# Altium schematic sheet 2560TK_Schematic.SchDoc
size A2; Organization: Altium Limited; Address1: L3, 12a Rodborough Rd; Address2: Frenchs Forest; Address3: NSW; Address4: Australia 2086
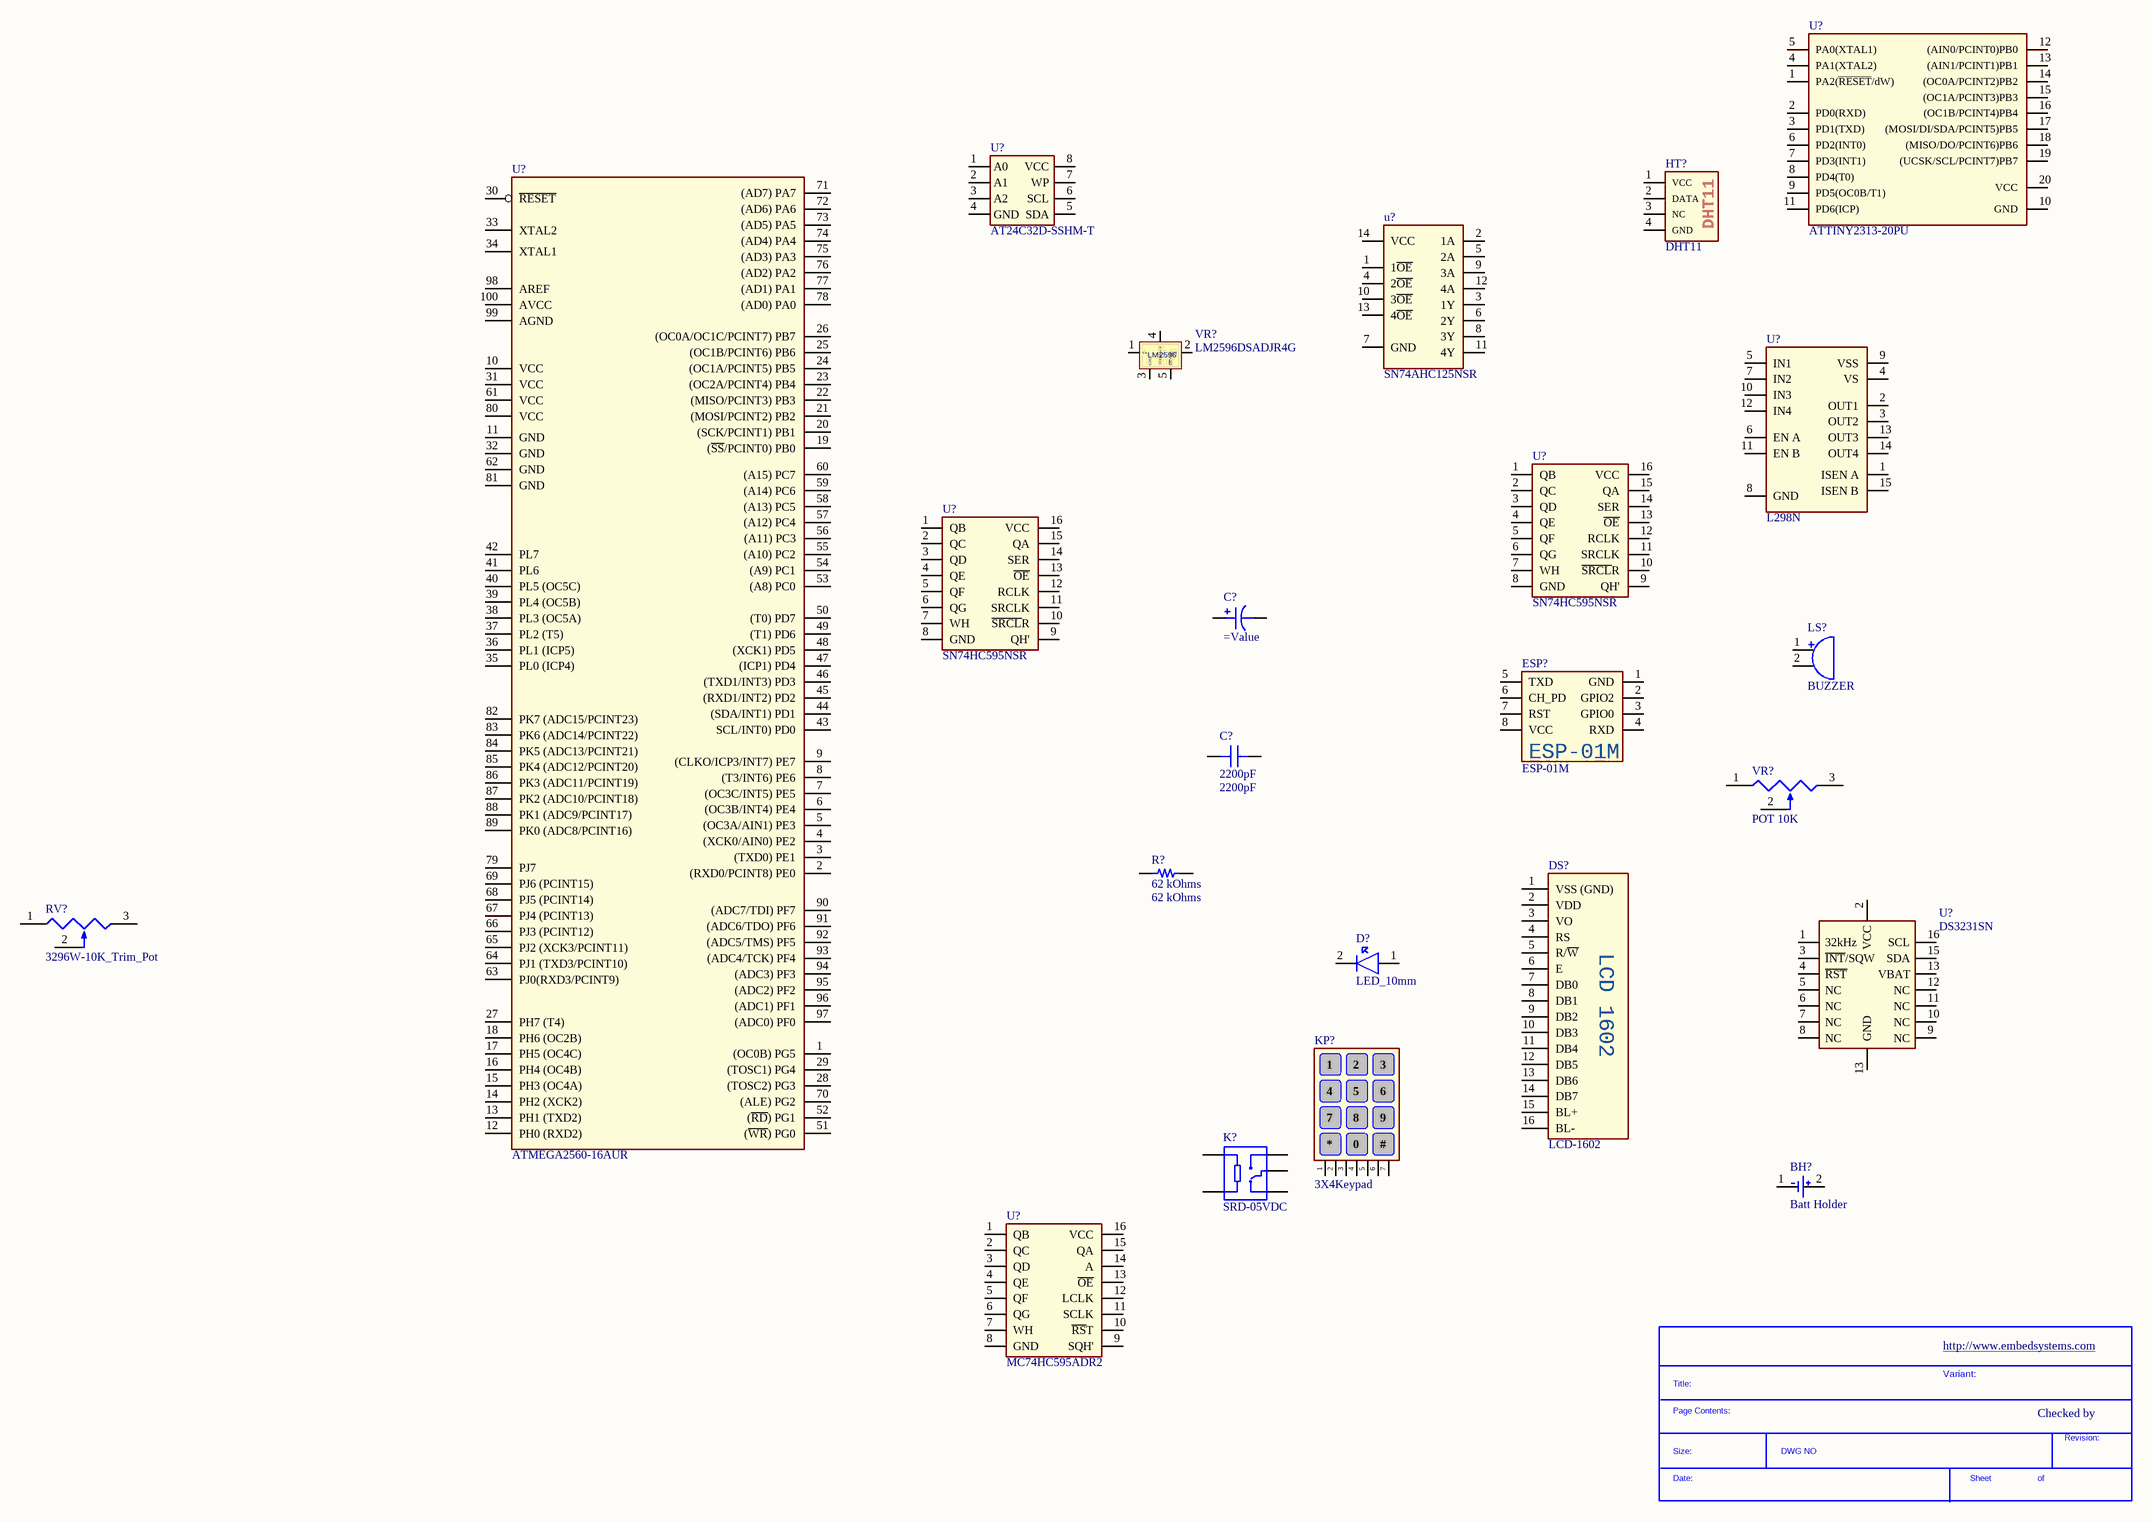
[diagram p0: 2560TK_Schematic.SchDoc]

## Parts
(Parts that share a designator on the sheet are numbered #1, #2 ... from top to bottom, then left to right.)
*?  SDTitleBlock  (value not drawn)  (graphical)
BH?  Batt Holder  [Batt Holder]
C?#1  (no value)  [CAP ALSMD POLY 4.3MM H5.5MM]
C?#2  2200pF  [CAP 0603_1608]
D?  LED_10mm  [LED_10mm]
DS?  LCD-1602  [LCD1602]
ESP?  ESP-01M  [ESP-01]
HT?  DHT11  [DHT11]
K?  SRD-05VDC  [SRD-05VDC]
KP?  3X4Keypad  [COM-08653]
LS?  BUZZER  [BUZZER]
R?  62 kOhms  [RES 0603_1608]
RV?  3296W-10K_Trim_Pot  [3296W_TrimPot]
U?#1  ATTINY2313-20PU  [DIP20]
U?#2  AT24C32D-SSHM-T  [8-Pin TTSOP]
u?#3  SN74AHC125NSR  [14-SOIC_5.3MM]
U?#4  L298N  [Multiwatt15]
U?#5  SN74HC595NSR  [SOIC16]
U?#6  SN74HC595NSR  [SOIC16]
U?#7  DS3231SN  [16 SO]
U?#8  ATMEGA2560-16AUR  [100pinTQFP]
U?#9  MC74HC595ADR2  [SOIC-16]
VR?#1  LM2596DSADJR4G  [D2PAK 5_LEAD]
VR?#2  POT 10K  [5MM_POT]

## Nets

Not connected (* = marked no-connect by the designer): BH? 1 2; C?#1 1 2; C?#2 1 2; D? 1 2; DS? 1(VSS_(GND)) 2(VDD) 3(VO) 4(RS) 5(R/~{W}) 6(E) 7(DB0) 8(DB1) 9(DB2) 10(DB3) 11(DB4) 12(DB5) 13(DB6) 14(DB7) 15(BL+) 16(BL-); ESP? 1(GND) 2(GPIO2) 3(GPIO0) 4(RXD) 5(TXD) 6(CH_PD) 7(RST) 8(VCC); HT? 1(VCC) 2(DATA) 3(NC) 4(GND); K? A1 A2 COM NC NO; KP? 1 2 3 4 5 6 7; LS? 1 2; R? 1 2; RV? 1 2 3; U?#1 1(PA2(~{RESET}/dW)) 2(PD0(RXD)) 3(PD1(TXD)) 4(PA1(XTAL2)) 5(PA0(XTAL1)) 6(PD2(INT0)) 7(PD3(INT1)) 8(PD4(T0)) 9(PD5(OC0B/T1)) 10(GND) 11(PD6(ICP)) 12((AIN0/PCINT0)PB0) 13((AIN1/PCINT1)PB1) 14((OC0A/PCINT2)PB2) 15((OC1A/PCINT3)PB3) 16((OC1B/PCINT4)PB4) 17((MOSI/DI/SDA/PCINT5)PB5) 18((MISO/DO/PCINT6)PB6) 19((UCSK/SCL/PCINT7)PB7) 20(VCC); U?#2 1(A0) 2(A1) 3(A2) 4(GND) 5(SDA) 6(SCL) 7(WP) 8(VCC); u?#3 1(1~{OE}) 2(1A) 3(1Y) 4(2~{OE}) 5(2A) 6(2Y) 7(GND) 8(3Y) 9(3A) 10(3~{OE}) 11(4Y) 12(4A) 13(4~{OE}) 14(VCC); U?#4 1(ISEN_A) 2(OUT1) 3(OUT2) 4(VS) 5(IN1) 6(EN_A) 7(IN2) 8(GND) 9(VSS) 10(IN3) 11(EN_B) 12(IN4) 13(OUT3) 14(OUT4) 15(ISEN_B); U?#5 1(QB) 2(QC) 3(QD) 4(QE) 5(QF) 6(QG) 7(WH) 8(GND) 9(QH') 10(~{SRCL}R) 11(SRCLK) 12(RCLK) 13(~{OE}) 14(SER) 15(QA) 16(VCC); U?#6 1(QB) 2(QC) 3(QD) 4(QE) 5(QF) 6(QG) 7(WH) 8(GND) 9(QH') 10(~{SRCL}R) 11(SRCLK) 12(RCLK) 13(~{OE}) 14(SER) 15(QA) 16(VCC); U?#7 1(32kHz) 2(VCC) 3(~{INT}/SQW) 4(~{RST}) 5(NC) 6(NC) 7(NC) 8(NC) 9(NC) 10(NC) 11(NC) 12(NC) 13(VBAT) 15(SDA) 16(SCL); U?#8 1((OC0B)_PG5) 2((RXD0/PCINT8)_PE0) 3((TXD0)_PE1) 4((XCK0/AIN0)_PE2) 5((OC3A/AIN1)_PE3) 6((OC3B/INT4)_PE4) 7((OC3C/INT5)_PE5) 8((T3/INT6)_PE6) 9((CLKO/ICP3/INT7)_PE7) 10(VCC) 11(GND) 12(PH0_(RXD2)) 13(PH1_(TXD2)) 14(PH2_(XCK2)) 15(PH3_(OC4A)) 16(PH4_(OC4B)) 17(PH5_(OC4C)) 18(PH6_(OC2B)) 19((~{SS}/PCINT0)_PB0) 20((SCK/PCINT1)_PB1) 21((MOSI/PCINT2)_PB2) 22((MISO/PCINT3)_PB3) 23((OC2A/PCINT4)_PB4) 24((OC1A/PCINT5)_PB5) 25((OC1B/PCINT6)_PB6) 26((OC0A/OC1C/PCINT7)_PB7) 27(PH7_(T4)) 28((TOSC2)_PG3) 29((TOSC1)_PG4) 30(~{RESET}) 31(VCC) 32(GND) 33(XTAL2) 34(XTAL1) 35(PL0_(ICP4)) 36(PL1_(ICP5)) 37(PL2_(T5)) 38(PL3_(OC5A)) 39(PL4_(OC5B)) 40(PL5_(OC5C)) 41(PL6) 42(PL7) 43(SCL/INT0)_PD0) 44((SDA/INT1)_PD1) 45((RXD1/INT2)_PD2) 46((TXD1/INT3)_PD3) 47((ICP1)_PD4) 48((XCK1)_PD5) 49((T1)_PD6) 50((T0)_PD7) 51((~{WR})_PG0) 52((~{RD})_PG1) 53((A8)_PC0) 54((A9)_PC1) 55((A10)_PC2) 56((A11)_PC3) 57((A12)_PC4) 58((A13)_PC5) 59((A14)_PC6) 60((A15)_PC7) 61(VCC) 62(GND) 63(PJ0(RXD3/PCINT9)) 64(PJ1_(TXD3/PCINT10)) 65(PJ2_(XCK3/PCINT11)) 66(PJ3_(PCINT12)) 67(PJ4_(PCINT13)) 68(PJ5_(PCINT14)) 69(PJ6_(PCINT15)) 70((ALE)_PG2) 71((AD7)_PA7) 72((AD6)_PA6) 73((AD5)_PA5) 74((AD4)_PA4) 75((AD3)_PA3) 76((AD2)_PA2) 77((AD1)_PA1) 78((AD0)_PA0) 79(PJ7) 80(VCC) 81(GND) 82(PK7_(ADC15/PCINT23)) 83(PK6_(ADC14/PCINT22)) 84(PK5_(ADC13/PCINT21)) 85(PK4_(ADC12/PCINT20)) 86(PK3_(ADC11/PCINT19)) 87(PK2_(ADC10/PCINT18)) 88(PK1_(ADC9/PCINT17)) 89(PK0_(ADC8/PCINT16)) 90((ADC7/TDI)_PF7) 91((ADC6/TDO)_PF6) 92((ADC5/TMS)_PF5) 93((ADC4/TCK)_PF4) 94((ADC3)_PF3) 95((ADC2)_PF2) 96((ADC1)_PF1) 97((ADC0)_PF0) 98(AREF) 99(AGND) 100(AVCC); U?#9 1(QB) 2(QC) 3(QD) 4(QE) 5(QF) 6(QG) 7(WH) 8(GND) 9(SQH') 10(~{RS}T) 11(SCLK) 12(LCLK) 13(~{OE}) 14(A) 15(QA) 16(VCC); VR?#1 1(Vin) 2(OUT) 3(GND) 4(FEEDBACK) 5(~{ON}/OFF); VR?#2 1 2 3

## Notes on the sheet
- http://www.embedsystems.com
- Variant:
- Checked by
- Title
- Size:
- Date:
- File:
- A2
- Number:
- Time:
- Revision:
- Sheet
- of
- (in symbol 3X4Keypad) 8; 9; 0; #
- (in symbol LCD-1602) LCD 1602
- (in symbol SDTitleBlock) Title:; Page Contents:; Revision:; Size:; DWG NO; Date:; Sheet; of

## Library data of the parts
BH? = Batt Holder: BATTERY HOLDER COIN 20MM PC PIN; Manufacturer: Memory Protection Devices; Manufacturer Part Number: BS-7; Number of Cells: 1; Supplier 1: Digi-Key; RoHS: No; Category: Batteries and Accessories; Stock 1: 55851; Pricing 1: 1=0.78000, 10=0.66000, 50=0.57880, 100=0.54570, 250=0.50236, 500=0.47176, 1000=0.44115, 2500=0.40290, 5000=0.37230 (USD); Mount: Through Hole,PCB; Min Operating Temperature: -55°C; Max Operating Temperature: 105°C; Package Quantity: 100; Termination: PC Pin; Diameter: 20mm; Lead Free: Lead Free; ComponentLink1URL: https://datasheet.ciiva.com/3/bs-7-datasheet-3824.pdf?src-supplier=Digi-Key; ComponentLink1Description: https://datasheet.ciiva.com/3/bs-7-datasheet-3824.pdf?src-supplier=Digi-Key; Supplier Part Number 1: BS-7-ND
C?#1 = EEE-1CA220WAR: CAP ALUM 22UF 20% 16V SMD; Part Number: EEE-1CA220WAR
C?#2 = C0603C222K5HACTU: CAP CER 2200PF 50V X8R 0603; Part Number: C0603C222K5HACTU; Value: 2200pF
D? = LED_10mm: 10MM Yellow Led; Manufacturer: SunLED; Manufacturer Part Number: XLMYK01D; Stock 1: 50; Pricing 1: 1=0.67000, 10=0.41100, 100=0.23650, 1000=0.18508, 2000=0.16966, 5000=0.15423, 10000=0.14395, 25000=0.13881 (USD); Supplier 1: Digi-Key; Supplier Part Number 1: 1497-XLMYK01D-ND
DS? = LCD-1602: LUMEX         LCM-S01602DTR/C             Alphanumeric LCD, 16 x 2, Black on Grey, 5V, Parallel, English, Japanese, Reflective; Number of Characters: 32; Character Height: 5.56mm; Character Width: 2.96mm; Background Color: Green; Number Of Characters Per Row: 16; Current Rating: 3mA; Viewing Area (width): 66mm; Viewing Area (height): 16mm; Supplier 1: Digi-Key; Manufacturer: Lumex; Manufacturer Part Number: LCM-S01602DTR/C; RoHS: Yes; Category: LCD, OLED, Graphic Displays; Stock 1: 70; Pricing 1: 1=11.49000, 10=8.33200, 100=6.88450, 500=6.02938, 1000=5.70050, 2000=5.56895, 5000=5.48125, 10000=5.37163 (USD); Case/Package: Module; Min Operating Temperature: 0°C; Max Operating Temperature: 50°C; Interface: Parallel; Operating Supply Voltage: 5V; Packaging: Bulk; Package Quantity: 45; Voltage Rating: 5V; Length: 85mm; Width: 85mm; Height: 30mm; REACH SVHC: No SVHC; Lead Free: Lead Free; ComponentLink1URL: https://datasheet.ciiva.com/1314/1701289-1314455.pdf?src-supplier=Newark; ComponentLink1Description: https://datasheet.ciiva.com/1314/1701289-1314455.pdf?src-supplier=Newark; ComponentLink2URL: https://datasheet.ciiva.com/1227/1701289-1227260.pdf?src-supplier=Element14; ComponentLink2Description: https://datasheet.ciiva.com/1227/1701289-1227260.pdf?src-supplier=Element14; Supplier Part Number 1: 67-1780-ND
ESP? = ESP-01M: TXRX ESP8266 MOD WIFI TRACE ANT; Manufacturer: Seeed Studio; Manufacturer Part Number: 317060016; RoHS: No; Category: Embedded Processors and Controllers; Stock 1: 190; Pricing 1: 1=7.09000 (USD); Case/Package: Module; Weight: 0.0625lb; Length: 3.25inch; Width: 2.25inch; Height: 0.25inch; ComponentLink1URL: https://media.digikey.com/pdf/Data%20Sheets/Seeed%20Technology/317060016_Web.pdf?src-supplier=Digi-Key; ComponentLink1Description: https://media.digikey.com/pdf/Data%20Sheets/Seeed%20Technology/317060016_Web.pdf?src-supplier=Digi-Key; Supplier 1: Digi-Key; Supplier Part Number 1: 1597-1145-ND
HT? = DHT11: SENSOR HUMID/TEMP 5V DTL 5% MOD; Manufacturer: Adafruit Industries; Manufacturer Part Number: 386; Response Time: 1s; Sensor Type: Temperature; Output Type: Digital; RoHS: Yes; Category: Optoelectronics; Stock 1: 753; Pricing 1: 1=5.00000 (USD); Mount: Chassis Mount; Min Operating Temperature: 0°C; Max Operating Temperature: 50°C; Accuracy: 5%; ComponentLink1URL: https://media.digikey.com/pdf/Data%20Sheets/Adafruit%20PDFs/DHT11_ProdManual.pdf?src-supplier=Digi-Key; ComponentLink1Description: https://media.digikey.com/pdf/Data%20Sheets/Adafruit%20PDFs/DHT11_ProdManual.pdf?src-supplier=Digi-Key; Supplier 1: Digi-Key; Supplier Part Number 1: 1528-1228-ND
K? = SRD-05VDC: TE CONNECTIVITY - 1-1721150-0 - POWER RELAY, SPDT, 277VAC, 10A, TH; Manufacturer: TE Connectivity P&B; Contact Current Rating: 15A; Coil Voltage (DC): 5V; Voltage Rating (AC): 125V; Manufacturer Part Number: 1-1721150-0; RoHS: Yes; Category: Signal Relays; Stock 1: 9261; Pricing 1: 1=1.34000, 10=1.26000, 25=1.12000, 50=1.06400, 100=1.00800, 250=0.89600, 500=0.84000, 1000=0.78400, 5000=0.75600 (USD); Mount: Through Hole; Number of Pins: 5; Weight: 9.5g; Max Operating Temperature: 85°C; Packaging: Rail/Tube; Throw Configuration: SPDT; Termination: PCB; Length: 19mm; Width: 15.5mm; Height: 15.8mm; Depth: 15.5mm; Lead Free: Lead Free; ELV: Compliant; ComponentLink1URL: https://datasheet.ciiva.com/14189/eng-cd-1721150-c-14189465.pdf?src-supplier=Avnet; ComponentLink1Description: https://datasheet.ciiva.com/14189/eng-cd-1721150-c-14189465.pdf?src-supplier=Avnet; ComponentLink2URL: https://datasheet.ciiva.com/48542/eng-cd-1721150-c-48542490.pdf?src-supplier=Onlinecomponents.com; ComponentLink2Description: https://datasheet.ciiva.com/48542/eng-cd-1721150-c-48542490.pdf?src-supplier=Onlinecomponents.com; Supplier 1: Digi-Key; Supplier Part Number 1: PB2032-ND
KP? = 3X4Keypad: 3x4 Matrix Keypad; Manufacturer: Adafruit Industries; Manufacturer Part Number: 3845; Stock 1: 43; Pricing 1: 1=6.50000 (USD); Supplier 1: Digi-Key; Supplier Part Number 1: 1528-2673-ND
LS? = BUZZER: AUDIO MAGNETIC XDCR 3-7V TH; Manufacturer: Projects Unlimited; Manufacturer Part Number: AT-1224-TWT-5V-2-R; Voltage Rating: 5V; Frequency: 2.4kHz; Operating Supply Current: 40mA; RoHS: Yes; Category: Audio Products; Stock 1: 83564; Pricing 1: 1=0.61000, 5=0.54600, 10=0.52000, 25=0.48640, 50=0.46120, 100=0.43680, 500=0.38252, 1000=0.36032, 5000=0.31168 (USD); Mount: Through Hole; Contact Plating: Tin; Min Operating Temperature: -30°C; Max Operating Temperature: 70°C; Packaging: Tray; Termination: PC Pins; Sensing Method: Magnetic; Max Supply Current: 40mA; Diameter: 12mm; Height: 9mm; ComponentLink1URL: http://www.mouser.com/ds/2/334/AT-1224-TWT-5V-2-R-532234.pdf?src-supplier=Mouser; ComponentLink1Description: http://www.mouser.com/ds/2/334/AT-1224-TWT-5V-2-R-532234.pdf?src-supplier=Mouser; ComponentLink2URL: http://www.puiaudio.com/pdf/AT-1224-TWT-5V-2-R.pdf?src-supplier=Digi-Key; ComponentLink2Description: http://www.puiaudio.com/pdf/AT-1224-TWT-5V-2-R.pdf?src-supplier=Digi-Key; ComponentLink3URL: http://www.puiaudio.com/pdf/AT-1224-TWT-5V-2-R.pdf?src-supplier=Avnet; ComponentLink3Description: http://www.puiaudio.com/pdf/AT-1224-TWT-5V-2-R.pdf?src-supplier=Avnet; Supplier 1: Digi-Key; Supplier Part Number 1: 668-1470-ND
R? = ERJ-PB3B6202V: RES SMD 62K OHM 0.1% 1/5W 0603; Part Number: ERJ-PB3B6202V; Value: 62 kOhms
RV? = 3296W-10K_Trim_Pot: TRIMMER 10K OHM 0.5W PC PIN TOP; Manufacturer: Bourns; Manufacturer Part Number: 3296W-1-103; Tolerance: 10%; Power Rating: 500mW; Resistance: 10kR; Number of Turns: 25; Temperature Coefficient: 100ppm/°C; Voltage Rating (DC): 500V; RoHS: No; Category: Variable Resistors and Potentiometers; Stock 1: 58; Pricing 1: 1=4.38000, 10=3.83600, 25=3.42520, 50=3.21960, 100=3.15100, 250=3.01400, 500=2.46600, 1000=2.12350, 5000=1.91800 (USD); Mount: PCB,Through Hole; Weight: 0.03oz; Color: Blue; Contact Plating: Tin,Lead; Min Operating Temperature: -55°C; Max Operating Temperature: 125°C; Package Quantity: 50; Packaging: Rail/Tube; Termination: Pin; Resistor Type: Cermet; Max Power Dissipation: 500mW; Taper: Linear; Series: Trimpot® 3296 - Sealed; Technology: CERMET; Resistance Tolerance: 10%; Length: 9.53mm; Width: 9.53mm; Height: 0.395inch; Depth: 4.83mm; Thickness: 5.59mm; Radiation Hardening: No; REACH SVHC: No SVHC; Military Standard: Not; RoHS Compliant: No; ComponentLink1URL: https://datasheet.ciiva.com/3266/3296-3266186.pdf?src-supplier=Avnet; ComponentLink1Description: https://datasheet.ciiva.com/3266/3296-3266186.pdf?src-supplier=Avnet; ComponentLink2URL: https://datasheet.ciiva.com/2164/3296-2164077.pdf?src-supplier=Digi-Key; ComponentLink2Description: https://datasheet.ciiva.com/2164/3296-2164077.pdf?src-supplier=Digi-Key; ComponentLink3URL: https://datasheet.ciiva.com/1570/1815117-1570414.pdf?src-supplier=Newark; ComponentLink3Description: https://datasheet.ciiva.com/1570/1815117-1570414.pdf?src-supplier=Newark; Supplier Part Number 1: 3296W-103-ND
U?#1 = ATTINY2313-20PU: ATMEL         ATTINY2313-20PU            8 Bit Microcontroller, Low Power High Performance, ATtiny, 20 MHz, 2 KB, 128 Byte, 20 Pins, DIP; Manufacturer: Microchip / Atmel; Interface: SPI,UART,USART; Min Supply Voltage: 2.7V; Max Supply Voltage: 5.5V; Frequency: 20MHz; Oscillator Type: Internal; Memory Type: FLASH,EEPROM; Memory Size: 2KB; Peripherals: Brown-out Detect/Reset,POR,PWM,WDT; Number of Timers/Counters: 2; RAM Size: 128B; Number of I/Os: 18; Number of PWM Channels: 4; Number of UART Channels: 1; Data Bus Width: 8b; Number of Bits: 8; Watchdog Timer: Yes; Access Time: 20us; Core Architecture: AVR; Manufacturer Part Number: ATTINY2313-20PU; RoHS: Yes; Category: Microcontrollers; Stock 1: 1963; Pricing 1: 1=1.93000, 25=1.77120, 100=1.59500 (USD); Mount: Through Hole; Case/Package: DIP; Number of Pins: 20; Contact Plating: Tin,Matte; Min Operating Temperature: -40°C; Max Operating Temperature: 85°C; Packaging: Rail/Tube; Package Quantity: 18; Density: 2KB; Number of Programmable I/O: 18; Max Frequency: 20MHz; Number of SPI Channels: 2; Number of I2C Channels: 1; Address Bus Width: 8b; Series: AVR® ATtiny; Length: 25.98mm; Width: 7.112mm; Height: 4.953mm; Radiation Hardening: No; RoHS Compliant: Yes; REACH SVHC: No SVHC; Lead Free: Lead Free; ComponentLink1URL: https://datasheet.ciiva.com/1167/doc2543-1167040.pdf?src-supplier=Newark; ComponentLink1Description: https://datasheet.ciiva.com/1167/doc2543-1167040.pdf?src-supplier=Newark; ComponentLink2URL: https://datasheet.ciiva.com/19481/1537061-19481586.pdf?src-supplier=Jameco; ComponentLink2Description: https://datasheet.ciiva.com/19481/1537061-19481586.pdf?src-supplier=Jameco; ComponentLink3URL: https://datasheet.ciiva.com/15122/getdatasheetpartid-143079-15122628.pdf?src-supplier=Verical; ComponentLink3Description: https://datasheet.ciiva.com/15122/getdatasheetpartid-143079-15122628.pdf?src-supplier=Verical; ComponentLink4URL: https://datasheet.ciiva.com/20168/73-4316-20168308.pdf?src-supplier=Rapid+Electronics; ComponentLink4Description: https://datasheet.ciiva.com/20168/73-4316-20168308.pdf?src-supplier=Rapid+Electronics; ComponentLink5URL: https://datasheet.ciiva.com/14132/gn645062-14132485.pdf?src-supplier=Distrelec; ComponentLink5Description: https://datasheet.ciiva.com/14132/gn645062-14132485.pdf?src-supplier=Distrelec; ComponentLink6URL: https://datasheet.ciiva.com/1158/1131078-1158423.pdf?src-supplier=Element14; ComponentLink6Description: https://datasheet.ciiva.com/1158/1131078-1158423.pdf?src-supplier=Element14; ComponentLink7URL: https://datasheet.ciiva.com/26207/doc2543-26207001.pdf?src-supplier=Avnet+Europe; ComponentLink7Description: https://datasheet.ciiva.com/26207/doc2543-26207001.pdf?src-supplier=Avnet+Europe; ComponentLink8URL: https://datasheet.ciiva.com/6639/doc2543-6639931.pdf?src-supplier=Digi-Key; ComponentLink8Description: https://datasheet.ciiva.com/6639/doc2543-6639931.pdf?src-supplier=Digi-Key; ComponentLink9URL: https://datasheet.ciiva.com/3203/doc2543-3203135.pdf?src-supplier=Avnet; ComponentLink9Description: https://datasheet.ciiva.com/3203/doc2543-3203135.pdf?src-supplier=Avnet; Supplier 1: Digi-Key; Supplier Part Number 1: ATTINY2313-20PU-ND
U?#2 = AT24C32D-SSHM-T: EEPROM Serial-2Wire 32K-bit 4K x 8 1.8V/2.5V/3.3V/5V 8-Pin SOIC T/R; Manufacturer: Microchip / Atmel; Min Supply Voltage: 1.7V; Max Supply Voltage: 5.5V; Access Time: 550ns; Density: 32Kb; Frequency: 1MHz; Nominal Supply Current: 3mA; Interface: I2C,Serial,2-Wire; Operating Supply Voltage: 5V; Organization: 4KX8; Write Protection: YES; Write Cycle Time-Max (tWC): 5ms; Manufacturer Part Number: AT24C32D-SSHM-T; RoHS: Yes; Category: EEPROM; Pricing 1: 1=0.44000 (USD); Mount: Surface Mount; Case/Package: SOIC; Number of Pins: 8; Min Operating Temperature: -40°C; Max Operating Temperature: 85°C; Packaging: Tape and Reel; Package Quantity: 1; Memory Type: EEPROM; Memory Size: 32Kb; Max Frequency: 1MHz; Voltage: 5V; Series: -; Access Time-Max: 550ns; Supply Current: 3mA; Supply Voltage-Nom: 5.5V; Radiation Hardening: No; REACH SVHC: No SVHC; Lead Free: Lead Free; RoHS Compliant: Yes; ComponentLink1URL: https://datasheet.ciiva.com/15123/getdatasheetpartid-320868-15123383.pdf?src-supplier=Verical; ComponentLink1Description: https://datasheet.ciiva.com/15123/getdatasheetpartid-320868-15123383.pdf?src-supplier=Verical; ComponentLink2URL: https://datasheet.ciiva.com/5700/1744693-5700966.pdf?src-supplier=Farnell; ComponentLink2Description: https://datasheet.ciiva.com/5700/1744693-5700966.pdf?src-supplier=Farnell; ComponentLink3URL: https://datasheet.ciiva.com/26869/at24c32d-sshm-t-26869756.pdf?src-supplier=IIIC; ComponentLink3Description: https://datasheet.ciiva.com/26869/at24c32d-sshm-t-26869756.pdf?src-supplier=IIIC; ComponentLink4URL: https://datasheet.ciiva.com/6615/atmel-8866-seeprom-at24c32d-datasheet-6615162.pdf?src-supplier=Digi-Key; ComponentLink4Description: https://datasheet.ciiva.com/6615/atmel-8866-seeprom-at24c32d-datasheet-6615162.pdf?src-supplier=Digi-Key; ComponentLink5URL: https://datasheet.ciiva.com/24168/atmel-8850-seeprom-at24c64d-datasheet-24168478.pdf?src-supplier=Future+Electronics; ComponentLink5Description: https://datasheet.ciiva.com/24168/atmel-8850-seeprom-at24c64d-datasheet-24168478.pdf?src-supplier=Future+Electronics; ComponentLink6URL: https://datasheet.ciiva.com/18617/atmel-8866-seeprom-at24c32d-datasheet-18617722.pdf?src-supplier=Digi-Key; ComponentLink6Description: https://datasheet.ciiva.com/18617/atmel-8866-seeprom-at24c32d-datasheet-18617722.pdf?src-supplier=Digi-Key; ComponentLink7URL: https://datasheet.ciiva.com/6615/atmel-8866-seeprom-at24c32d-datasheet-6615163.pdf?src-supplier=Digi-Key; ComponentLink7Description: https://datasheet.ciiva.com/6615/atmel-8866-seeprom-at24c32d-datasheet-6615163.pdf?src-supplier=Digi-Key; ComponentLink8URL: https://datasheet.ciiva.com/22729/1744693-22729500.pdf?src-supplier=Element14; ComponentLink8Description: https://datasheet.ciiva.com/22729/1744693-22729500.pdf?src-supplier=Element14; ComponentLink9URL: https://datasheet.ciiva.com/22618/1744693-22618573.pdf?src-supplier=Element14; ComponentLink9Description: https://datasheet.ciiva.com/22618/1744693-22618573.pdf?src-supplier=Element14; Supplier Part Number 1: AT24C32D-SSHM-TCT-ND
u?#3 = SN74AHC125NSR: Buffer/Line Driver 4-CH Non-Inverting 3-ST CMOS 14-Pin SOP T/R; Manufacturer: Texas Instruments; Number of Elements: 4; Max Supply Voltage: 5.5V; Min Supply Voltage: 2V; Propagation Delay: 7.5ns; Logic Function: Buffer,Inverting; Number of Bits per Element: 1; High Level Output Current: -8mA; Low Level Output Current: 8mA; Turn-On Delay Time: 15ns; Quiescent Current: 4uA; Output Type: 3-STATE; Manufacturer Part Number: SN74AHC125NSR; RoHS: Yes; Category: Buffers, Drivers and Transceivers; Stock 1: 3905; Pricing 1: 1=0.43000, 10=0.36600, 25=0.34120, 100=0.27310, 250=0.25356, 500=0.21454, 1000=0.16578 (USD); Mount: Surface Mount; Case/Package: SO; Number of Pins: 14; Min Operating Temperature: -40°C; Max Operating Temperature: 125°C; Package Quantity: 2000; Packaging: Tape and Reel; Number of Channels: 4; Number of Inputs: 4; Number of Outputs: 4; Number of Input Lines: 4; Number of Output Lines: 4; Polarity: Non-Inverting; Number of Bits: 4; Series: 74AHC; Technology: CMOS; Lead Free: Lead Free; RoHS Compliant: Yes; ComponentLink1URL: https://datasheet.ciiva.com/6623/sn74ahc125-6623637.pdf?src-supplier=Digi-Key; ComponentLink1Description: https://datasheet.ciiva.com/6623/sn74ahc125-6623637.pdf?src-supplier=Digi-Key; Supplier 1: Digi-Key; Supplier Part Number 1: 296-31733-1-ND
U?#4 = L298N: Motor / Motion / Ignition Controllers & Drivers Dual Full Bridge; Manufacturer: STMicroelectronics; Number of Outputs: 4; Output Current: 2A; Output Voltage: 46V; Operating Supply Voltage: 42V; Min Supply Voltage: 4.8V; Max Output Current: 3A; Operating Supply Current: 13mA; Quiescent Current: 500mA; Number of Drivers: 2; Motor Type: Brushed; Output Impedance: 24mR; Manufacturer Part Number: L298N; RoHS: Yes; Category: Motor Drivers; Stock 1: 13112; Pricing 1: 1=5.15000, 10=4.62700, 25=4.37400, 100=3.59650, 250=3.22712, 500=3.11046, 1000=2.58557, 2500=2.48837, 5000=2.47590 (USD); Mount: Through Hole; Number of Pins: 15; Min Operating Temperature: -25°C; Max Operating Temperature: 130°C; Packaging: Rail/Tube; Max Supply Voltage: 46V; Package Quantity: 25; Output Current per Channel: 2A; Max Collector Current: 3A; Collector Emitter Voltage (VCEO): 46V; Series: -; Length: 19.6mm; Width: 5mm; Height: 10.7mm; Radiation Hardening: No; REACH SVHC: No SVHC; Lead Free: Lead Free; RoHS Compliant: Yes; ComponentLink1URL: https://datasheet.ciiva.com/15109/getdatasheetpartid-50682-15109332.pdf?src-supplier=Verical; ComponentLink1Description: https://datasheet.ciiva.com/15109/getdatasheetpartid-50682-15109332.pdf?src-supplier=Verical; ComponentLink2URL: https://datasheet.ciiva.com/19456/245403-19456698.pdf?src-supplier=Jameco; ComponentLink2Description: https://datasheet.ciiva.com/19456/245403-19456698.pdf?src-supplier=Jameco; ComponentLink3URL: https://datasheet.ciiva.com/25626/0900766b80060c26-25626619.pdf?src-supplier=RSComponents; ComponentLink3Description: https://datasheet.ciiva.com/25626/0900766b80060c26-25626619.pdf?src-supplier=RSComponents; ComponentLink4URL: https://datasheet.ciiva.com/14150/ofl298n-647108-dat-en-14150301.pdf?src-supplier=Distrelec; ComponentLink4Description: https://datasheet.ciiva.com/14150/ofl298n-647108-dat-en-14150301.pdf?src-supplier=Distrelec; ComponentLink5URL: https://datasheet.ciiva.com/29306/156128-da-01-en-dual-bridge-driv-l298n-29306997.pdf?src-supplier=Conrad; ComponentLink5Description: https://datasheet.ciiva.com/29306/156128-da-01-en-dual-bridge-driv-l298n-29306997.pdf?src-supplier=Conrad; ComponentLink6URL: https://datasheet.ciiva.com/26880/l298n-26880153.pdf?src-supplier=IIIC; ComponentLink6Description: https://datasheet.ciiva.com/26880/l298n-26880153.pdf?src-supplier=IIIC; ComponentLink7URL: https://datasheet.ciiva.com/1608/1693054-1608165.pdf?src-supplier=Newark; ComponentLink7Description: https://datasheet.ciiva.com/1608/1693054-1608165.pdf?src-supplier=Newark; ComponentLink8URL: https://datasheet.ciiva.com/1500/1693054-1500714.pdf?src-supplier=Element14; ComponentLink8Description: https://datasheet.ciiva.com/1500/1693054-1500714.pdf?src-supplier=Element14; ComponentLink9URL: https://datasheet.ciiva.com/1501/1693054-1501547.pdf?src-supplier=Element14; ComponentLink9Description: https://datasheet.ciiva.com/1501/1693054-1501547.pdf?src-supplier=Element14; ComponentLink10URL: https://datasheet.ciiva.com/1955/cd00000240-1955436.pdf?src-supplier=Digi-Key; ComponentLink10Description: https://datasheet.ciiva.com/1955/cd00000240-1955436.pdf?src-supplier=Digi-Key; ComponentLink11URL: https://datasheet.ciiva.com/4895/cd00000240-4895919.pdf?src-supplier=Mouser; ComponentLink11Description: https://datasheet.ciiva.com/4895/cd00000240-4895919.pdf?src-supplier=Mouser; Supplier 1: Digi-Key; Supplier Part Number 1: 497-1395-5-ND
U?#5 U?#6 = SN74HC595NSR: Shift Register Single 8-Bit Serial to Serial/Parallel 16-Pin SOP T/R; Manufacturer: Texas Instruments; Number of Elements: 1; Min Supply Voltage: 2V; Max Supply Voltage: 6V; Operating Supply Voltage: 5V; Propagation Delay: 34ns; Direction: Unidirectional; Number of Output Lines: 9; Number of Bits per Element: 8; Turn-On Delay Time: 250ns; Quiescent Current: 8uA; Output Type: 3-STATE; Manufacturer Part Number: SN74HC595NSR; RoHS: Yes; Category: Shift Registers; Stock 1: 3063; Pricing 1: 1=0.60000, 10=0.51700, 25=0.48240, 100=0.38580, 250=0.35828, 500=0.30316, 1000=0.23426 (USD); Mount: Surface Mount; Case/Package: SOP; Number of Pins: 16; Weight: 0.007079oz; Contact Plating: Gold; Min Operating Temperature: -40°C; Max Operating Temperature: 85°C; Packaging: Tape and Reel; Package Quantity: 2000; Logic Function: Shift Register; Number of Circuits: 1; Number of Input Lines: 1; Number of Bits: 8; Series: 74HC; Technology: CMOS; Radiation Hardening: No; REACH SVHC: No SVHC; Lead Free: Lead Free; RoHS Compliant: Yes; ComponentLink1URL: https://datasheet.ciiva.com/26807/getdatasheetpartid-39956-26807430.pdf?src-supplier=Verical; ComponentLink1Description: https://datasheet.ciiva.com/26807/getdatasheetpartid-39956-26807430.pdf?src-supplier=Verical; ComponentLink2URL: https://datasheet.ciiva.com/14296/sn74hc595-14296695.pdf?src-supplier=Avnet; ComponentLink2Description: https://datasheet.ciiva.com/14296/sn74hc595-14296695.pdf?src-supplier=Avnet; ComponentLink3URL: https://datasheet.ciiva.com/1886/sn74hc595-1886315.pdf?src-supplier=Digi-Key; ComponentLink3Description: https://datasheet.ciiva.com/1886/sn74hc595-1886315.pdf?src-supplier=Digi-Key; ComponentLink4URL: https://datasheet.ciiva.com/1886/sn74hc595-1886316.pdf?src-supplier=Digi-Key; ComponentLink4Description: https://datasheet.ciiva.com/1886/sn74hc595-1886316.pdf?src-supplier=Digi-Key; ComponentLink5URL: https://datasheet.ciiva.com/1886/sn74hc595-1886317.pdf?src-supplier=Digi-Key; ComponentLink5Description: https://datasheet.ciiva.com/1886/sn74hc595-1886317.pdf?src-supplier=Digi-Key; ComponentLink6URL: https://datasheet.ciiva.com/48704/001074736-da-01-en-ic-shift-regist-sn74hc595nsr-soic-16-tid-48704219.pdf?src-supplier=Conrad; ComponentLink6Description: https://datasheet.ciiva.com/48704/001074736-da-01-en-ic-shift-regist-sn74hc595nsr-soic-16-tid-48704219.pdf?src-supplier=Conrad; Supplier 1: Digi-Key; Supplier Part Number 1: 296-26485-1-ND
U?#7 = DS3231SN: MAXIM INTEGRATED PRODUCTS - DS3231SN#T&R - IC, RTC, Datum-/Zeitformat (Tag/Datum/Monat/Jahr, hh:mm:ss), I2C, 2.3V-5.5V Versorgung, SOIC-16; Max Supply Voltage: 5.5V; Min Supply Voltage: 2.3V; Interface: I2C,Serial,2-Wire; Logic Function: Clock; Date Format: YY-MM-DD-dd; Operating Supply Voltage: 3.3V; Supplier 1: Digi-Key; Manufacturer: Maxim; Manufacturer Part Number: DS3231SN#T&R; RoHS: Yes; Category: Real Time Clocks; Stock 1: 4168; Pricing 1: 1=8.82000, 10=7.96700, 25=7.59600, 100=6.59560, 250=6.29920, 500=5.74336 (USD); Mount: Surface Mount; Case/Package: SOIC; Number of Pins: 16; Contact Plating: Tin,Matte; Min Operating Temperature: -40°C; Max Operating Temperature: 85°C; Packaging: Tape and Reel; Package Quantity: 1000; Time Format: HH:MM:SS; Series: -; Radiation Hardening: No; Lead Free: Lead Free; RoHS Compliant: Yes; ComponentLink1URL: https://datasheet.ciiva.com/17307/ds3231-17307128.pdf?src-supplier=Avnet+Europe; ComponentLink1Description: https://datasheet.ciiva.com/17307/ds3231-17307128.pdf?src-supplier=Avnet+Europe; ComponentLink2URL: https://datasheet.ciiva.com/12291/ds3231-102175-12291260.pdf?src-supplier=Mouser; ComponentLink2Description: https://datasheet.ciiva.com/12291/ds3231-102175-12291260.pdf?src-supplier=Mouser; ComponentLink3URL: https://datasheet.ciiva.com/14244/ds3231-14244637.pdf?src-supplier=Avnet; ComponentLink3Description: https://datasheet.ciiva.com/14244/ds3231-14244637.pdf?src-supplier=Avnet; ComponentLink4URL: https://datasheet.ciiva.com/14244/ds3231-14244733.pdf?src-supplier=Avnet; ComponentLink4Description: https://datasheet.ciiva.com/14244/ds3231-14244733.pdf?src-supplier=Avnet; Supplier Part Number 1: DS3231SN#T&RCT-ND
U?#8 = ATMEGA2560-16AUR: ATMEGA2560 IC MCU 8BIT 256KB FLASH 100TQFP; Manufacturer: Microchip / Atmel; RAM Size: 8KB; Interface: I2C,SPI,UART,USART,EBI/EMI; Number of I/Os: 86; Number of Timers/Counters: 6; Frequency: 16MHz; Operating Supply Voltage: 5V; Max Supply Voltage: 5.5V; Min Supply Voltage: 4.5V; Oscillator Type: Internal; Data Bus Width: 8b; Watchdog Timer: Yes; Peripherals: Brown-out Detect/Reset,POR,PWM,WDT; Core Architecture: AVR; Supplier 1: Digi-Key; Manufacturer Part Number: ATMEGA2560-16AUR; RoHS: Yes; Category: Microcontrollers; Stock 1: 900; Pricing 1: 1=11.99000, 25=10.99000, 100=9.95010 (USD); Mount: Surface Mount; Case/Package: A; Number of Pins: 100; Contact Plating: Tin,Matte; Min Operating Temperature: -40°C; Max Operating Temperature: 85°C; Package Quantity: 1500; Packaging: Tape and Reel; Number of Programmable I/O: 86; Max Frequency: 16MHz; Memory Type: FLASH; Memory Size: 256KB; REACH SVHC: No SVHC; Lead Free: Lead Free; ComponentLink1URL: https://datasheet.ciiva.com/6641/atmel-2549-8-bit-avr-microcontroller-atmega640-1280-1281-2560-2561-summary-6641242.pdf?src-supplier=Digi-Key; ComponentLink1Description: https://datasheet.ciiva.com/6641/atmel-2549-8-bit-avr-microcontroller-atmega640-1280-1281-2560-2561-summary-6641242.pdf?src-supplier=Digi-Key; ComponentLink2URL: https://datasheet.ciiva.com/6641/atmel-2549-8-bit-avr-microcontroller-atmega640-1280-1281-2560-2561-summary-6641243.pdf?src-supplier=Digi-Key; ComponentLink2Description: https://datasheet.ciiva.com/6641/atmel-2549-8-bit-avr-microcontroller-atmega640-1280-1281-2560-2561-summary-6641243.pdf?src-supplier=Digi-Key; ComponentLink3URL: https://datasheet.ciiva.com/6641/atmel-2549-8-bit-avr-microcontroller-atmega640-1280-1281-2560-2561-summary-6641244.pdf?src-supplier=Digi-Key; ComponentLink3Description: https://datasheet.ciiva.com/6641/atmel-2549-8-bit-avr-microcontroller-atmega640-1280-1281-2560-2561-summary-6641244.pdf?src-supplier=Digi-Key; Supplier Part Number 1: ATMEGA2560-16AURCT-ND
U?#9 = MC74HC595ADR2: IC SHIFT REGISTR 8BIT 3ST 16SOIC; Manufacturer: ON Semiconductor; Propagation Delay: 24ns; Max Supply Voltage: 6V; Number of Elements: 1; Number of Circuits: 2; Number of Input Lines: 3; Logic Function: Shift Register; Number of Bits per Element: 8; Output Type: 3-STATE; Manufacturer Part Number: MC74HC595ADR2; RoHS: No; Category: Shift Registers; Mount: Surface Mount; Case/Package: SOIC; Number of Pins: 16; Min Operating Temperature: -55°C; Max Operating Temperature: 125°C; Packaging: Tape and Reel; Package Quantity: 1; Number of Output Lines: 3; Number of Bits: 8; Voltage: 6V; Series: 74HC; Lead Free: Contains Lead; RoHS Compliant: No; ComponentLink1URL: https://datasheet.ciiva.com/1887/mc74hc595a-d-1887894.pdf?src-supplier=Digi-Key; ComponentLink1Description: https://datasheet.ciiva.com/1887/mc74hc595a-d-1887894.pdf?src-supplier=Digi-Key; ComponentLink2URL: https://datasheet.ciiva.com/1887/mc74hc595a-d-1887895.pdf?src-supplier=Digi-Key; ComponentLink2Description: https://datasheet.ciiva.com/1887/mc74hc595a-d-1887895.pdf?src-supplier=Digi-Key; Supplier 1: Digi-Key; Supplier Part Number 1: MC74HC595ADR2OSCT-ND
VR?#1 = LM2596DSADJR4G: Sw. Regulator 3A Adj. Step-Down D2PAK-5; Manufacturer: ON Semiconductor; Number of Outputs: 1; Max Input Voltage: 40V; Min Input Voltage: 4.5V; Output Voltage: 37V; Efficiency: 73%; Switching Frequency: 150kHz; Synchronous Rectifier: No; Min Output Voltage: 1.23V; Topology: Buck-Boost; Output Type: Adjustable; Supplier 1: Digi-Key; Manufacturer Part Number: LM2596DSADJR4G; RoHS: Yes; Category: Voltage Regulators - Switching; Stock 1: 3215; Pricing 1: 1=2.24000, 10=2.01100, 25=1.89760, 100=1.59390 (USD); Mount: Surface Mount; Case/Package: D2PAK; Number of Pins: 5; Min Operating Temperature: -40°C; Max Operating Temperature: 125°C; Max Output Current: 3A; Packaging: Tape and Reel; Output Current: 3A; Package Quantity: 800; Max Output Voltage: 37V; Operating Supply Voltage: 40V; Series: LM2596; Switching Frequency-Max: 150kHz; Length: 10.24mm; Width: 4.572mm; Height: 9.347mm; Radiation Hardening: No; REACH SVHC: No SVHC; Lead Free: Lead Free; Halogen Free: Halogen Free; RoHS Compliant: Yes; ComponentLink1URL: https://datasheet.ciiva.com/15113/getdatasheetpartid-224280-15113862.pdf?src-supplier=Verical; ComponentLink1Description: https://datasheet.ciiva.com/15113/getdatasheetpartid-224280-15113862.pdf?src-supplier=Verical; ComponentLink2URL: https://datasheet.ciiva.com/6603/lm2596-d-6603896.pdf?src-supplier=Digi-Key; ComponentLink2Description: https://datasheet.ciiva.com/6603/lm2596-d-6603896.pdf?src-supplier=Digi-Key; ComponentLink3URL: https://datasheet.ciiva.com/6603/lm2596-d-6603897.pdf?src-supplier=Digi-Key; ComponentLink3Description: https://datasheet.ciiva.com/6603/lm2596-d-6603897.pdf?src-supplier=Digi-Key; ComponentLink4URL: https://datasheet.ciiva.com/6603/lm2596-d-6603898.pdf?src-supplier=Digi-Key; ComponentLink4Description: https://datasheet.ciiva.com/6603/lm2596-d-6603898.pdf?src-supplier=Digi-Key; ComponentLink5URL: https://datasheet.ciiva.com/8270/lm2596-d-8270188.pdf?src-supplier=Avnet; ComponentLink5Description: https://datasheet.ciiva.com/8270/lm2596-d-8270188.pdf?src-supplier=Avnet; Supplier Part Number 1: LM2596DSADJR4GOSCT-ND
VR?#2 = POT 10K: Res Conductive Plastic POT 10K Ohm 20% 1/5W 1(Elec)/1(Mech)Turn 6mm Pin Panel Mount/Through Hole; Manufacturer: TT BI; Manufacturer Part Number: P160KN2-0QA25B10K; Number of Gangs: 1; Resistance: 10kR; Power Rating: 200mW; Actuator Length: 0.984inch; Actuator Diameter: 0.236inch; Supplier 1: Digi-Key; RoHS: Yes; Category: Variable Resistors and Potentiometers; Stock 1: 2543; Pricing 1: 1=0.79000, 10=0.71300, 25=0.64400, 50=0.62100, 100=0.58650, 250=0.56352, 880=0.50600, 1760=0.43700, 5280=0.35650 (USD); Mount: Panel; Min Operating Temperature: -20°C; Max Operating Temperature: 70°C; Taper: Linear; Number of Turns: 1; Termination: Pin; Tolerance: 20%; Packaging: Tray; Package Quantity: 100; Max Power Dissipation: 200mW; Type: Potentiometer; Resistor Type: Conductive Plastic; Length: 34.5mm; Depth: 17mm; Military Standard: Not; ComponentLink1URL: https://datasheet.ciiva.com/48425/p160-eng-tds-48425253.pdf?src-supplier=Distrelec; ComponentLink1Description: https://datasheet.ciiva.com/48425/p160-eng-tds-48425253.pdf?src-supplier=Distrelec; Supplier Part Number 1: 987-1715-ND